# EAGLE schematic Reciever_Reed (EAGLE 7.5.0)
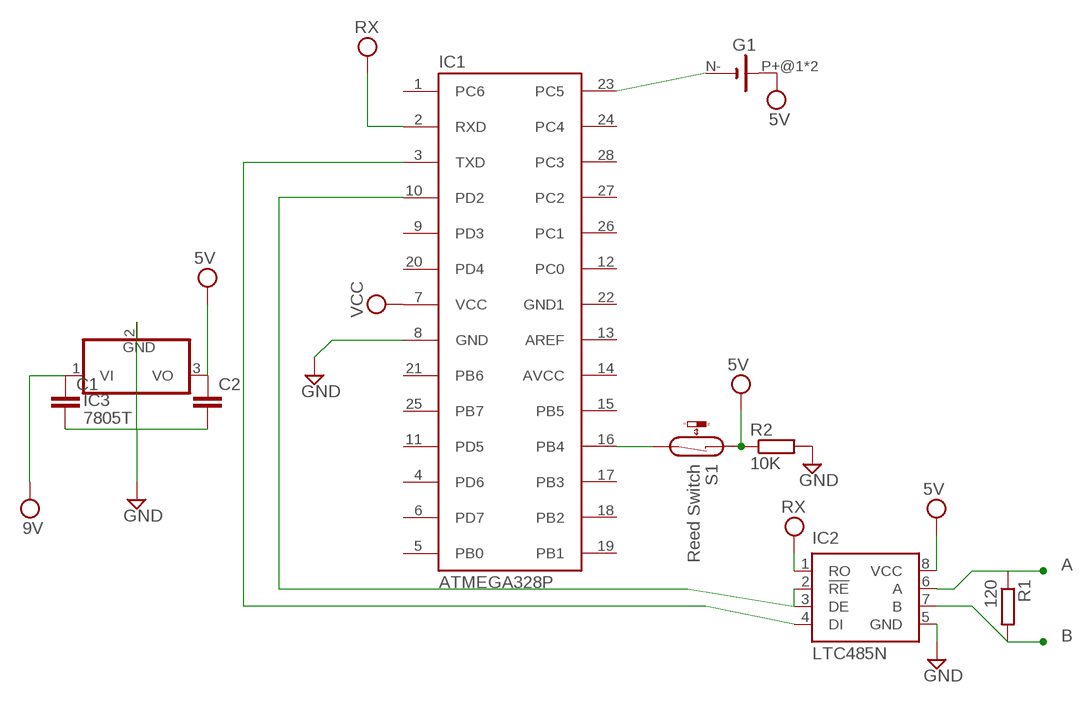
[diagram p0: schematic, sheet 1]

## Parts
C1  C-EU050-030X075  [C050-030X075]
C2  C-EU050-030X075  [C050-030X075]
G1  BATTERY-HOLDER_11.6MM  [CELL_RETAINER_11.6MM]
IC1  ATMEGA328P  [DIL28-3]
IC2  LTC485N  [DIL08]
IC3  7805T  [TO220H]
R1  120  R  [R0805]
R2  10K  R  [R0805]
S1  Reed Switch  REED-SWITCH-CT10-1530-G1  [CT10-G1]

## Nets
A: IC2.6(A) R1.1
B: IC2.7(B) R1.2
GND: C1.2 C2.2 IC1.8(GND) IC2.5(GND) IC3.2(GND) R2.2
N$2: G1.N-(-) IC1.23(PC5)
N$3: IC1.16(PB4) S1.2
N$4: IC1.10(PD2) IC2.2(!RE) IC2.3(DE)
N$5: IC1.3(TXD) IC2.4(DI)
VCC: C1.1 C2.1 G1.P+@1(+) G1.P+@2(+) IC1.2(RXD) IC1.7(VCC) IC2.1(RO) IC2.8(VCC) IC3.1(VI) IC3.3(VO) R2.1 S1.1 ; supply symbol labelled 9V, 5V, RX
Unconnected: IC1.1(PC6) IC1.4(PD6) IC1.5(PB0) IC1.6(PD7) IC1.9(PD3) IC1.11(PD5) IC1.12(PC0) IC1.13(AREF) IC1.14(AVCC) IC1.15(PB5) IC1.17(PB3) IC1.18(PB2) IC1.19(PB1) IC1.20(PD4) IC1.21(PB6) IC1.24(PC4) IC1.25(PB7) IC1.26(PC1) IC1.27(PC2) IC1.28(PC3)

## Power pins joined to a net without a drawn wire
GND1: IC1.22(GND1)

## Library data of the parts
C1 C2 = rcl:C-EU: CAPACITOR, European symbol
G1 = battery:BATTERY-HOLDER_11.6MM: 11.6mm PC BUTTON CELL RETAINER, high 5.97mm KEYSTONE ELECTRONICS CORP. Data sheet <http://www.farnell.com/cad/1718310.pdf>; MF: KEYSTONE; MPN: 2997; OC_FARNELL: 2293265
IC1 = Arduino-AVR:ATMEGA328P
IC2 = linear-technology:LTC485: Low Power RS485 Interface Transceiver Source: http://www.linear.com/pc/downloadDocument.do?navId=H0,C1,C1007,C1017,P2064,D1718; OC_FARNELL: unknown; OC_NEWARK: unknown
IC3 = linear:78*: Positive VOLTAGE REGULATOR Source: http://cache.national.com/ds/LM/LM78L05.pdf http://www.fairchildsemi.com/ds/LM/LM7805.pdf
R1 R2 = eagle-ltspice:R: RESISTOR, European symbol; SPICEMODEL: NONE; SPICEPREFIX: R
S1 = switch-reed:REED-SWITCH-: Reed Sensor; MF: COTO TECHNOLOGY; MPN: CT10-1530-G1; OC_FARNELL: 1081696